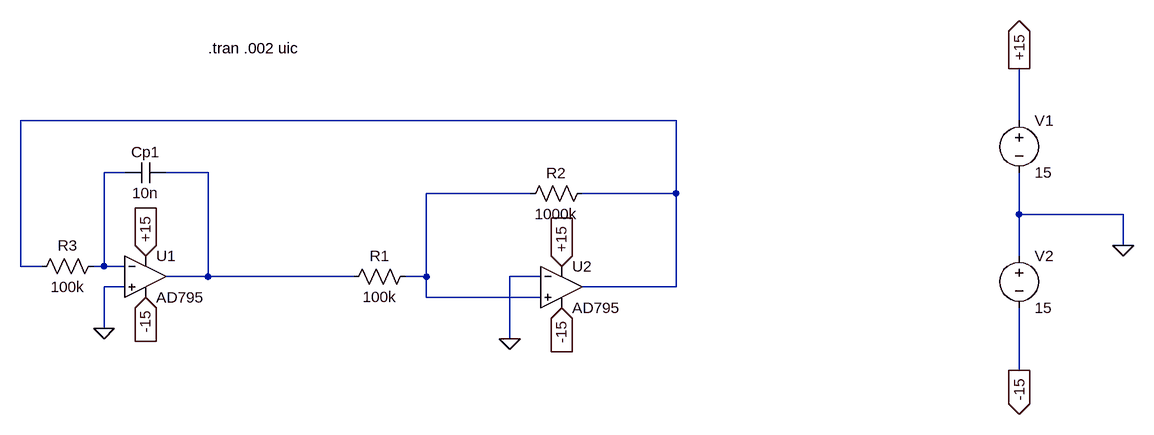
[diagram p0: schematic Multivibrador_Astavel_Triangular_NEW.asc]
Multivibrador_Astavel_Triangular_NEW.asc, the LTspice schematic file:
Version 4
SHEET 1 1076 912
WIRE 368 112 -640 112
WIRE 896 112 896 32
WIRE -480 192 -512 192
WIRE -352 192 -416 192
WIRE 144 224 -16 224
WIRE 368 224 368 112
WIRE 368 224 224 224
WIRE 896 256 896 192
WIRE 1056 256 896 256
WIRE 1056 304 1056 256
WIRE 896 320 896 256
WIRE -640 336 -640 112
WIRE -608 336 -640 336
WIRE -512 336 -512 192
WIRE -512 336 -528 336
WIRE -480 336 -512 336
WIRE -352 352 -352 192
WIRE -352 352 -416 352
WIRE -128 352 -352 352
WIRE -16 352 -16 224
WIRE -16 352 -48 352
WIRE 160 352 112 352
WIRE -480 368 -512 368
WIRE 368 368 368 224
WIRE 368 368 224 368
WIRE -16 384 -16 352
WIRE 160 384 -16 384
WIRE -512 432 -512 368
WIRE 112 448 112 352
WIRE 896 496 896 400
FLAG 112 448 0
FLAG 1056 304 0
FLAG 896 32 +15
IOPIN 896 32 Out
FLAG 896 496 -15
IOPIN 896 496 Out
FLAG 192 336 +15
IOPIN 192 336 In
FLAG 192 400 -15
IOPIN 192 400 In
FLAG -448 320 +15
IOPIN -448 320 In
FLAG -448 384 -15
IOPIN -448 384 In
FLAG -512 432 0
SYMBOL res 240 208 R90
WINDOW 0 0 56 VBottom 2
WINDOW 3 32 56 VTop 2
SYMATTR InstName R2
SYMATTR Value 1000k
SYMBOL res -32 336 R90
WINDOW 0 0 56 VBottom 2
WINDOW 3 32 56 VTop 2
SYMATTR InstName R1
SYMATTR Value 100k
SYMBOL voltage 896 96 R0
WINDOW 123 0 0 Left 2
WINDOW 39 24 124 Left 2
SYMATTR InstName V1
SYMATTR Value 15
SYMBOL voltage 896 304 R0
WINDOW 123 0 0 Left 2
WINDOW 39 0 0 Left 2
SYMATTR InstName V2
SYMATTR Value 15
SYMBOL Opamps\\AD795 192 304 R0
SYMATTR InstName U2
SYMBOL Opamps\\AD795 -448 288 R0
SYMATTR InstName U1
SYMBOL res -512 320 R90
WINDOW 0 0 56 VBottom 2
WINDOW 3 32 56 VTop 2
SYMATTR InstName R3
SYMATTR Value 100k
SYMBOL cap -480 208 R270
WINDOW 0 32 32 VTop 2
WINDOW 3 0 32 VBottom 2
SYMATTR InstName Cp1
SYMATTR Value 10n
TEXT -352 0 Left 2 !.tran .002 uic

The netlist it stands for:
* Multivibrador_Astavel_Triangular_NEW.asc
R2 N001 N004 1000k
R1 N004 N003 100k
V1 +15 0 15
V2 0 -15 15
XU2 N004 0 +15 -15 N001 AD795  ; pins In+ In- V+ V- OUT
XU1 0 N002 +15 -15 N003 AD795  ; pins In+ In- V+ V- OUT
R3 N002 N001 100k
Cp1 N002 N003 10n
.tran .002 uic
.lib ADI1.lib
.backanno
.end